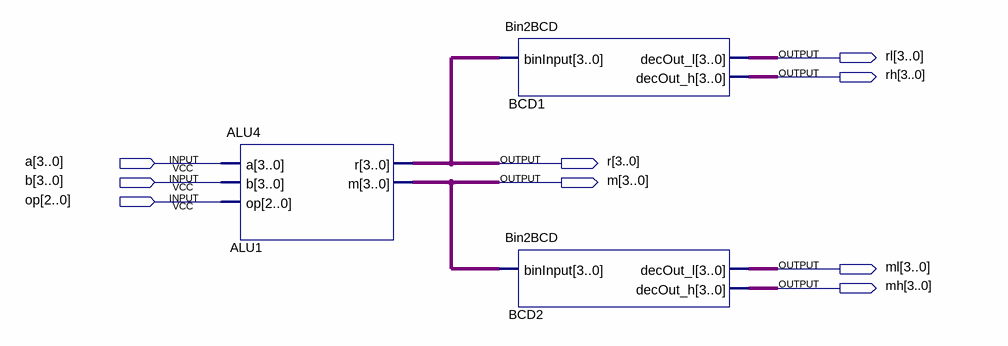
[diagram p0: schematic sheet]
// Quartus schematic ALUDemo.bdf as structural Verilog: 3 symbols, 9 pins
module ALUDemo (
  input  [3:0] a,
  input  [3:0] b,
  input  [2:0] op,
  output [3:0] rl,
  output [3:0] rh,
  output [3:0] r,
  output [3:0] m,
  output [3:0] ml,
  output [3:0] mh
);

  ALU4 ALU1 (.a(a), .b(b), .op(op), .r(r), .m(m));
  Bin2BCD BCD1 (.binInput(r), .decOut_l(rl), .decOut_h(rh));
  Bin2BCD BCD2 (.binInput(m), .decOut_l(ml), .decOut_h(mh));
endmodule
